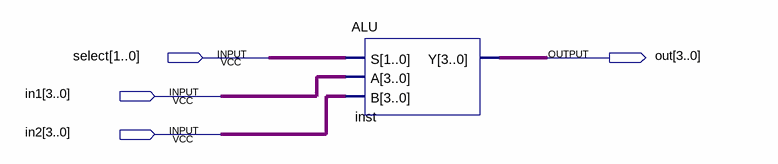
[diagram p0: schematic sheet]
// Quartus schematic sol.bdf as structural Verilog: 1 symbols, 4 pins
module sol (
  input  [1:0] select,
  input  [3:0] in1,
  input  [3:0] in2,
  output [3:0] out
);

  ALU inst (.S(select), .A(in1), .B(in2), .Y(out));
endmodule
